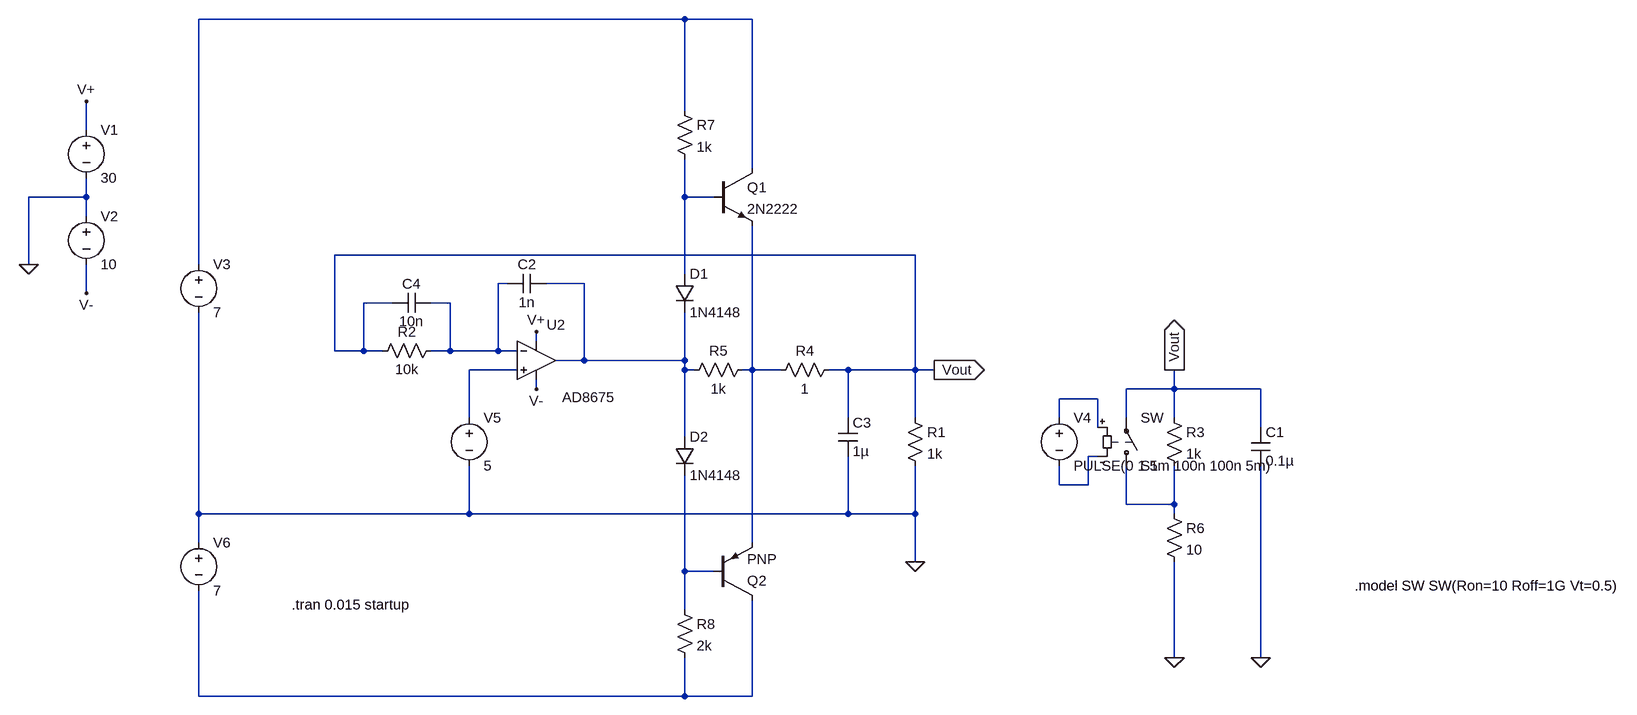
[diagram p0: schematic push_pull.asc]
push_pull.asc, the LTspice schematic file:
Version 4
SHEET 1 3036 1304
WIRE 768 32 -192 32
WIRE 880 32 768 32
WIRE 768 320 768 32
WIRE -576 352 -576 304
WIRE 880 416 880 32
WIRE -576 464 -576 432
WIRE -576 464 -672 464
WIRE 768 464 768 400
WIRE 816 464 768 464
WIRE -576 496 -576 464
WIRE 1152 560 48 560
WIRE -672 576 -672 464
WIRE -192 576 -192 32
WIRE 768 592 768 464
WIRE 336 608 320 608
WIRE 464 608 400 608
WIRE -576 624 -576 576
WIRE 144 640 96 640
WIRE 240 640 208 640
WIRE 384 704 384 688
WIRE 48 720 48 560
WIRE 96 720 96 640
WIRE 96 720 48 720
WIRE 128 720 96 720
WIRE 240 720 240 640
WIRE 240 720 208 720
WIRE 320 720 320 608
WIRE 320 720 240 720
WIRE 352 720 320 720
WIRE 464 736 464 608
WIRE 464 736 416 736
WIRE 768 736 768 656
WIRE 768 736 464 736
WIRE 352 752 272 752
WIRE 768 752 768 736
WIRE 784 752 768 752
WIRE 880 752 880 512
WIRE 880 752 864 752
WIRE 928 752 880 752
WIRE 1040 752 1008 752
WIRE 1152 752 1152 560
WIRE 1152 752 1040 752
WIRE 1184 752 1152 752
WIRE 384 784 384 768
WIRE 1584 784 1584 752
WIRE 1584 784 1504 784
WIRE 1728 784 1584 784
WIRE 1456 800 1392 800
WIRE 272 832 272 752
WIRE 1040 832 1040 752
WIRE 1152 832 1152 752
WIRE 1392 832 1392 800
WIRE 1504 832 1504 784
WIRE 1584 832 1584 784
WIRE 1456 848 1456 800
WIRE 1728 848 1728 784
WIRE 768 864 768 752
WIRE 1456 896 1440 896
WIRE 1392 944 1392 912
WIRE 1440 944 1440 896
WIRE 1440 944 1392 944
WIRE 1504 976 1504 912
WIRE 1584 976 1584 912
WIRE 1584 976 1504 976
WIRE -192 992 -192 656
WIRE 272 992 272 912
WIRE 272 992 -192 992
WIRE 1040 992 1040 896
WIRE 1040 992 272 992
WIRE 1152 992 1152 912
WIRE 1152 992 1040 992
WIRE 1584 992 1584 976
WIRE -192 1040 -192 992
WIRE 880 1040 880 752
WIRE 1152 1072 1152 992
WIRE 768 1088 768 928
WIRE 816 1088 768 1088
WIRE 768 1152 768 1088
WIRE 1584 1232 1584 1072
WIRE 1728 1232 1728 912
WIRE -192 1296 -192 1120
WIRE 768 1296 768 1232
WIRE 768 1296 -192 1296
WIRE 880 1296 880 1136
WIRE 880 1296 768 1296
FLAG -576 304 V+
FLAG -576 624 V-
FLAG 1584 1232 0
FLAG -672 576 0
FLAG 384 688 V+
FLAG 384 784 V-
FLAG 1728 1232 0
FLAG 1152 1072 0
FLAG 1184 752 Vout
IOPIN 1184 752 Out
FLAG 1584 752 Vout
IOPIN 1584 752 Out
SYMBOL voltage -576 336 R0
WINDOW 123 0 0 Left 0
WINDOW 39 0 0 Left 0
SYMATTR InstName V1
SYMATTR Value 30
SYMBOL voltage -576 480 R0
WINDOW 123 0 0 Left 0
WINDOW 39 0 0 Left 0
SYMATTR InstName V2
SYMATTR Value 10
SYMBOL voltage -192 560 R0
WINDOW 123 0 0 Left 0
WINDOW 39 0 0 Left 0
SYMATTR InstName V3
SYMATTR Value 7
SYMBOL Opamps\\AD8675 384 672 R0
WINDOW 0 17 5 Left 2
WINDOW 3 43 126 Left 2
SYMATTR InstName U2
SYMBOL voltage 272 816 R0
WINDOW 123 0 0 Left 0
WINDOW 39 0 0 Left 0
SYMATTR InstName V5
SYMATTR Value 5
SYMBOL res 1568 816 R0
SYMATTR InstName R3
SYMATTR Value 1k
SYMBOL cap 1712 848 R0
SYMATTR InstName C1
SYMATTR Value 0.1µ
SYMATTR SpiceLine Rser=0.05
SYMBOL res 112 736 R270
WINDOW 0 32 56 VTop 2
WINDOW 3 0 56 VBottom 2
SYMATTR InstName R2
SYMATTR Value 10k
SYMBOL cap 336 592 M90
WINDOW 0 0 32 VBottom 2
WINDOW 3 32 32 VTop 2
SYMATTR InstName C2
SYMATTR Value 1n
SYMBOL sw 1504 928 M180
SYMATTR InstName S1
SYMBOL voltage 1392 816 R0
WINDOW 123 0 0 Left 0
WINDOW 39 0 0 Left 0
SYMATTR InstName V4
SYMATTR Value PULSE(0 1 5m 100n 100n 5m)
SYMBOL res 1568 976 R0
SYMATTR InstName R6
SYMATTR Value 10
SYMBOL npn 816 416 R0
SYMATTR InstName Q1
SYMATTR Value 2N2222
SYMBOL voltage -192 1024 R0
WINDOW 123 0 0 Left 0
WINDOW 39 0 0 Left 0
SYMATTR InstName V6
SYMATTR Value 7
SYMBOL pnp 816 1136 M180
SYMATTR InstName Q2
SYMBOL res 1136 816 R0
SYMATTR InstName R1
SYMATTR Value 1k
SYMBOL res 1024 736 R90
WINDOW 0 0 56 VBottom 2
WINDOW 3 32 56 VTop 2
SYMATTR InstName R4
SYMATTR Value 1
SYMBOL cap 1024 832 R0
SYMATTR InstName C3
SYMATTR Value 1µ
SYMBOL res 880 736 R90
WINDOW 0 0 56 VBottom 2
WINDOW 3 32 56 VTop 2
SYMATTR InstName R5
SYMATTR Value 1k
SYMBOL cap 144 624 M90
WINDOW 0 0 32 VBottom 2
WINDOW 3 32 32 VTop 2
SYMATTR InstName C4
SYMATTR Value 10n
SYMBOL diode 752 592 R0
SYMATTR InstName D1
SYMATTR Value 1N4148
SYMBOL res 752 304 R0
SYMATTR InstName R7
SYMATTR Value 1k
SYMBOL res 752 1136 R0
SYMATTR InstName R8
SYMATTR Value 2k
SYMBOL diode 752 864 R0
SYMATTR InstName D2
SYMATTR Value 1N4148
TEXT -24 1144 Left 2 !.tran 0.015 startup
TEXT 2496 1112 Left 2 !.model SW SW(Ron=10 Roff=1G Vt=0.5)

The netlist it stands for:
* push_pull.asc
V1 V+ 0 30
V2 0 V- 10
V3 N001 0 7
XU2 N005 N003 V+ V- N004 AD8675  ; pins In+ In- V+ V- OUT
V5 N005 0 5
R3 Vout N009 1k
C1 Vout 0 0.1µ Rser=0.05
R2 Vout N003 10k
C2 N003 N004 1n
S1 N009 Vout N007 N008 SW
V4 N007 N008 PULSE(0 1 5m 100n 100n 5m)
R6 N009 0 10
Q1 N001 N002 N006 0 2N2222
V6 0 N011 7
Q2 N011 N010 N006 0 PNP
R1 Vout 0 1k
R4 Vout N006 1
C3 Vout 0 1µ
R5 N006 N004 1k
C4 Vout N003 10n
D1 N002 N004 1N4148
R7 N001 N002 1k
R8 N010 N011 2k
D2 N004 N010 1N4148
.model D D
.lib standard.dio
.model NPN NPN
.model PNP PNP
.lib standard.bjt
.tran 0.015 startup
.model SW SW(Ron=10 Roff=1G Vt=0.5)
.backanno
.end